# EAGLE schematic Display de vidas y nivel (EAGLE 7.7.0)
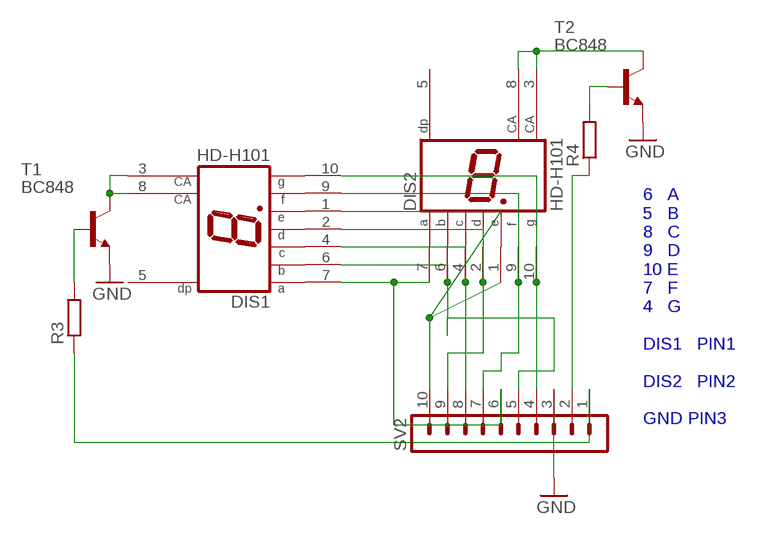
[diagram p0: schematic, sheet 1]

## Parts
DIS1  HD-H101  [HDSP-M]
DIS2  HD-H101  [HDSP-M]
R3  R-EU_M0805  [M0805]
R4  R-EU_M0805  [M0805]
SV2  MA10-1  [MA10-1]
T1  BC848  [SOT23]
T2  BC848  [SOT23]

## Nets
GND: SV2.3 T1.2(E) T2.2(E)
N$1: R3.2 T1.1(B)
N$2: DIS1.6(B) DIS2.6(B) SV2.5
N$3: DIS1.4(C) DIS2.4(C) SV2.8
N$4: DIS1.2(D) DIS2.2(D) SV2.9
N$5: DIS1.1(E) DIS2.1(E) SV2.10
N$6: DIS1.9(F) DIS2.9(F) SV2.7
N$7: DIS1.10(G) DIS2.10(G) SV2.4
N$8: DIS1.3(CA) DIS1.8(CA) T1.3(C)
N$9: DIS2.3(CA) DIS2.8(CA) T2.3(C)
N$10: R3.1 SV2.1
N$11: R4.1 SV2.2
N$12: R4.2 T2.1(B)
N$13: DIS1.7(A) DIS2.7(A) SV2.6
Unconnected: DIS1.5(DP) DIS2.5(DP)

## Notes on the sheet
- 6   A
  5   B
  8   C
  9   D
  10 E
  7   F
  4   G
  
  DIS1   PIN1
  
  DIS2   PIN2
  
  GND PIN3

## Library data of the parts
DIS1 DIS2 = display-hp:HD-H101: LED DISPLAY 1-character 7 segment, decimal point right; OC_FARNELL: unknown; OC_NEWARK: unknown
R3 R4 = rcl:R-EU_: RESISTOR, European symbol
SV2 = con-lstb:MA10-1: PIN HEADER; OC_FARNELL: unknown; OC_NEWARK: unknown
T1 T2 = transistor:BC848: NPN TRANSISTOR